# Altium schematic sheet S08OB383-0311_S08OB383-031.schdoc.schdoc
size 127 x 101 mm
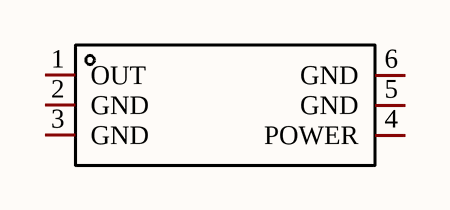
[diagram p0: S08OB383-0311_S08OB383-031.schdoc.schdoc]

## Parts
MIC?  S08OB383-031  [MIC-SMD_6P-L3.8-W3.0-TL]  (value not drawn)

## Nets

Not connected (* = marked no-connect by the designer): MIC? 1(OUT) 2(GND) 3(GND) 4(POWER) 5(GND) 6(GND)

## Library data of the parts
MIC? = S08OB383-031: Manufacturer: Goertek(歌尔); Add into BOM: yes; Direction: 全指向; Supply Voltage: 2V; Current Consumption: 250uA; SNR(Signal to Noise Ratio): 62dB; Sensitivity: -38dB; Impedance: 300Ω; Symbol: S08OB383-031; Device: S08OB383-031; LCSC Part Name: MEMS麦克风 1.5V-3.3V 灵敏度-38dB; Supplier Part: C233789; Manufacturer Part: S08OB383-031; Supplier Footprint: SMD-6P,3x3.8mm; JLCPCB Part Class: Extended Part; Datasheet: https://atta.szlcsc.com/upload/public/pdf/source/20180813/C233789_E04AB53437DBF6EB77A7471B347B78C1.pdf; Supplier: LCSC; Convert to PCB: yes